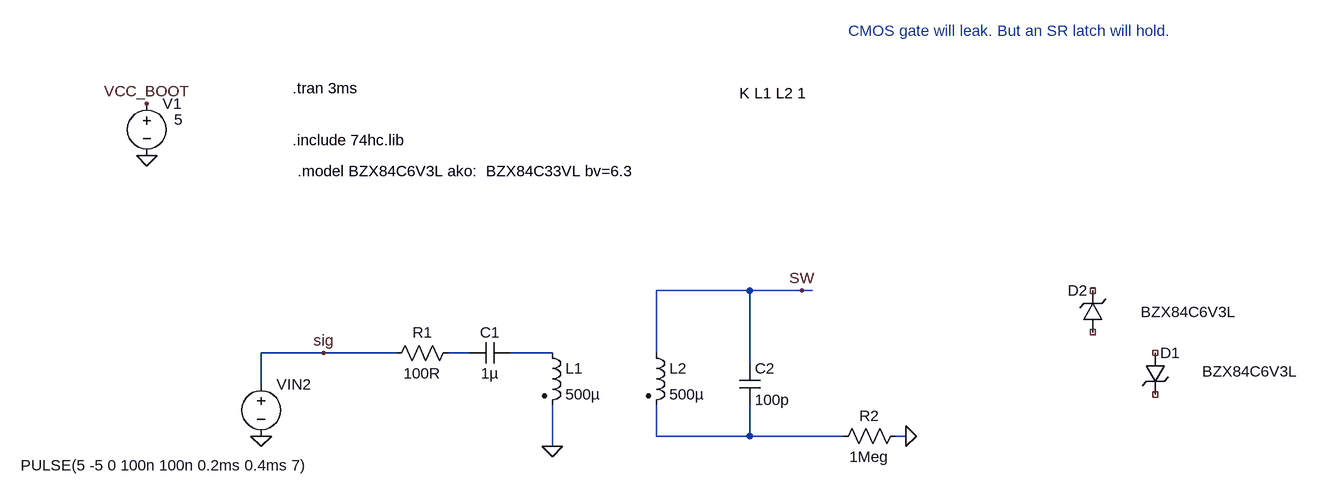
[diagram p0: schematic Draft57.asc]
Draft57.asc, the LTspice schematic file:
Version 4
SHEET 1 2756 1020
WIRE 1120 240 976 240
WIRE 1200 240 1120 240
WIRE 1216 240 1200 240
WIRE 464 336 368 336
WIRE 576 336 464 336
WIRE 688 336 656 336
WIRE 816 336 752 336
WIRE 976 336 976 240
WIRE 1120 352 1120 240
WIRE 368 384 368 336
WIRE 976 464 976 416
WIRE 1120 464 1120 416
WIRE 1120 464 976 464
WIRE 1264 464 1120 464
WIRE 1360 464 1344 464
WIRE 816 480 816 416
FLAG 368 464 0
FLAG 1200 240 SW
FLAG 464 336 sig
FLAG 816 480 0
FLAG 192 -48 VCC_BOOT
FLAG 192 32 0
FLAG 1360 464 0
SYMBOL voltage 192 -64 R0
WINDOW 123 0 0 Left 0
WINDOW 39 0 0 Left 0
WINDOW 3 42 41 Left 2
SYMATTR Value 5
SYMATTR InstName V1
SYMBOL voltage 368 368 R0
WINDOW 123 0 0 Left 0
WINDOW 39 0 0 Left 0
WINDOW 3 -370 141 Left 2
SYMATTR Value PULSE(5 -5 0 100n 100n 0.2ms 0.4ms 7)
SYMATTR InstName VIN2
SYMBOL ind2 800 320 R0
SYMATTR InstName L1
SYMATTR Value 500µ
SYMATTR Type ind
SYMBOL ind2 960 320 R0
SYMATTR InstName L2
SYMATTR Value 500µ
SYMATTR Type ind
SYMBOL zener 1728 336 R0
WINDOW 3 88 28 Left 2
SYMATTR InstName D1
SYMATTR Value BZX84C6V3L
SYMBOL zener 1664 304 R180
WINDOW 0 24 64 Left 2
WINDOW 3 -205 31 Left 2
SYMATTR InstName D2
SYMATTR Value BZX84C6V3L
SYMBOL res 672 320 R90
WINDOW 0 0 56 VBottom 2
WINDOW 3 32 56 VTop 2
SYMATTR InstName R1
SYMATTR Value 100R
SYMBOL cap 752 320 R90
WINDOW 0 0 32 VBottom 2
WINDOW 3 32 32 VTop 2
SYMATTR InstName C1
SYMATTR Value 1µ
SYMBOL cap 1104 352 R0
SYMATTR InstName C2
SYMATTR Value 100p
SYMBOL res 1360 448 R90
WINDOW 0 0 56 VBottom 2
WINDOW 3 32 56 VTop 2
SYMATTR InstName R2
SYMATTR Value 1Meg
TEXT 416 -72 Left 2 !.tran 3ms
TEXT 416 8 Left 2 !.include 74hc.lib
TEXT 1272 -160 Left 2 ;CMOS gate will leak. But an SR latch will hold.
TEXT 1104 -64 Left 2 !K L1 L2 1
TEXT 424 56 Left 2 !.model BZX84C6V3L ako:  BZX84C33VL bv=6.3

The netlist it stands for:
* Draft57.asc
V1 VCC_BOOT 0 5
VIN2 sig 0 PULSE(5 -5 0 100n 100n 0.2ms 0.4ms 7)
L1 N002 0 500µ
L2 SW N003 500µ
D1 NC_01 NC_02 BZX84C6V3L
D2 NC_03 NC_04 BZX84C6V3L
R1 N001 sig 100R
C1 N002 N001 1µ
C2 SW N003 100p
R2 0 N003 1Meg
.model D D
.lib standard.dio
.tran 3ms
.include 74hc.lib
* CMOS gate will leak. But an SR latch will hold.
K L1 L2 1
.model BZX84C6V3L ako:  BZX84C33VL bv=6.3
.backanno
.end